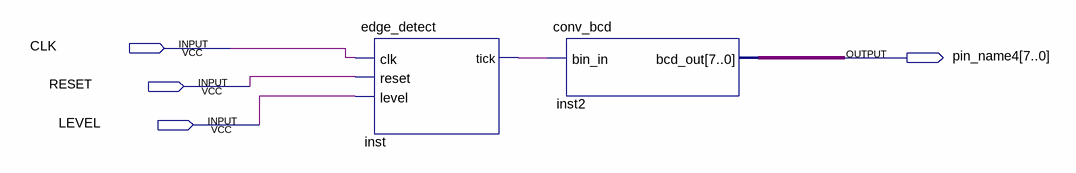
[diagram p0: schematic sheet]
// Quartus schematic BlocDiagram.bdf as structural Verilog: 2 symbols, 4 pins
module BlocDiagram (
  input  CLK,
  input  RESET,
  input  LEVEL,
  output [7:0] pin_name4
);

  wire inst_tick;

  edge_detect inst (.clk(CLK), .reset(RESET), .level(LEVEL), .tick(inst_tick));
  conv_bcd inst2 (.bin_in(inst_tick), .bcd_out(pin_name4));
endmodule
